# Altium schematic sheet 5_bp_filter.SchDoc
size A; SheetNumber: 5; SheetTotal: 9
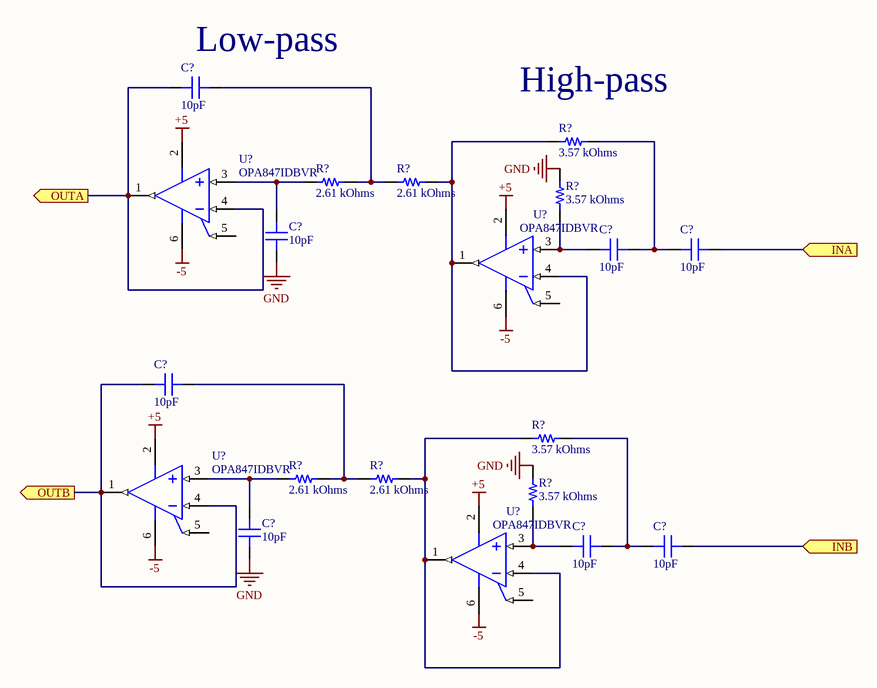
[diagram p0: 5_bp_filter.SchDoc]

## Parts
(Parts that share a designator on the sheet are numbered #1, #2 ... from top to bottom, then left to right.)
C?#1  10pF  [CAP 1206_3216 - 1.0MM]
C?#2  10pF  [CAP 1206_3216 - 1.0MM]
C?#3  10pF  [CAP 1206_3216 - 1.0MM]
C?#4  10pF  [CAP 1206_3216 - 1.0MM]
C?#5  10pF  [CAP 1206_3216 - 1.0MM]
C?#6  10pF  [CAP 1206_3216 - 1.0MM]
C?#7  10pF  [CAP 1206_3216 - 1.0MM]
C?#8  10pF  [CAP 1206_3216 - 1.0MM]
R?#1  3.57 kOhms  [RES 1206_3216]
R?#2  2.61 kOhms  [RES 1206_3216]
R?#3  2.61 kOhms  [RES 1206_3216]
R?#4  3.57 kOhms  [RES 1206_3216]
R?#5  3.57 kOhms  [RES 1206_3216]
R?#6  2.61 kOhms  [RES 1206_3216]
R?#7  2.61 kOhms  [RES 1206_3216]
R?#8  3.57 kOhms  [RES 1206_3216]
U?#1  OPA847IDBVR  [DBV0006A_L]
U?#2  OPA847IDBVR  [DBV0006A_L]
U?#3  OPA847IDBVR  [DBV0006A_L]
U?#4  OPA847IDBVR  [DBV0006A_L]

## Ports
INA (in), INB (in), OUTA (out), OUTB (out)

## Nets
+5: U?#1.2(VS-) U?#2.2(VS-) U?#3.2(VS-) U?#4.2(VS-)
-5: U?#1.6(VS+) U?#2.6(VS+) U?#3.6(VS+) U?#4.6(VS+)
GND: C?#2.1 C?#6.1 R?#4.1 R?#8.1
INA: C?#4.2 ; port INA
INB: C?#8.2 ; port INB
OUTA: C?#1.1 U?#1.1(OUT) U?#1.4(IN-) ; port OUTA
OUTB: C?#5.1 U?#3.1(OUT) U?#3.4(IN-) ; port OUTB
NetC?#1_2: C?#1.2 R?#2.2 R?#3.1
NetC?#2_2: C?#2.2 R?#2.1 U?#1.3(IN+)
NetC?#3_1: C?#3.1 R?#4.2 U?#2.3(IN+)
NetC?#3_2: C?#3.2 C?#4.1 R?#1.2
NetC?#5_2: C?#5.2 R?#6.2 R?#7.1
NetC?#6_2: C?#6.2 R?#6.1 U?#3.3(IN+)
NetC?#7_1: C?#7.1 R?#8.2 U?#4.3(IN+)
NetC?#7_2: C?#7.2 C?#8.1 R?#5.2
NetR?#1_1: R?#1.1 R?#3.2 U?#2.1(OUT) U?#2.4(IN-)
NetR?#5_1: R?#5.1 R?#7.2 U?#4.1(OUT) U?#4.4(IN-)

Not connected (* = marked no-connect by the designer): U?#1 5(~{DIS}); U?#2 5(~{DIS}); U?#3 5(~{DIS}); U?#4 5(~{DIS})

## Notes on the sheet
- (near C?#1) Low-pass
- (near R?#1) High-pass

## Library data of the parts
C?#1-C?#8 = 12065A100JAT2A: CAP CER 10PF 50V C0G/NP0 1206; manufacturer: AVX Corporation; Temperature Coefficient: C0G, NP0; Tolerance: ±5%; Part Number: 12065A100JAT2A; Value: 10pF; Applications: General Purpose; Capacitance: 10pF; componentlink1description: Datasheet; componentlink1url: http://datasheets.avx.com/C0GNP0-Dielectric.pdf; componentlink2description: DigiKey Link; componentlink2url: http://digikey.com/product-detail/en/avx-corporation/12065A100JAT2A/478-1468-1-ND/564500; Device Package: 1206 (3216 Metric); lastupdated: 2020-09-02 01:04:55; Lifecycle Status: Active; Minimum Order: 1; Mounting Type: Surface Mount, MLCC; Operating Temperature: -55°C ~ 125°C; Package / Case: 1206 (3216 Metric); packaging: TapeAndReel; partid: 21175; Part Status: Active; price: 0.07; series: -; Size / Dimension: 0.126" L x 0.063" W (3.20mm x 1.60mm); Supplier 1: DigiKey; Supplier Part Number 1: 478-1468-1-ND; Thickness (Max): 0.037" (0.94mm); Voltage - Rated: 50V
R?#1 R?#4 R?#5 R?#8 = RC1206FR-073K57L: RES 3.57K OHM 1% 1/4W 1206; Manufacturer: Yageo; Power (Watts): 0.25W, 1/4W; Temperature Coefficient: ±100ppm/°C; Part Number: RC1206FR-073K57L; ComponentLink1Description: Datasheet; ComponentLink1URL: https://www.yageo.com/upload/media/product/productsearch/datasheet/rchip/PYu-RC_Group_51_RoHS_L_10.pdf; ComponentLink2Description: DigiKey Link; ComponentLink2URL: https://www.digikey.com/en/products/detail/yageo/RC1206FR-073K57L/728778; Composition: Thick Film; Device Package: 1206 (3216 Metric); Features: Moisture Resistant; Height - Seated (Max): 0.026" (0.65mm); LastUpdated: 2022-09-19 13:29:15; Lifecycle Status: Active; Minimum Order: 1; Number of Terminations: 2; Operating Temperature: -55°C ~ 155°C; Package / Case: 1206 (3216 Metric); Packaging: TapeAndReel; PartId: 35871; Part Status: Active; Price: 0.01; Resistance: 3.57 kOhms; Series: RC_L; Size / Dimension: 0.122" L x 0.063" W (3.10mm x 1.60mm); Supplier 1: DigiKey; Supplier Part Number 1: 311-3.57KFRCT-ND; Supplier Device Package: 1206; Tolerance: ±1%; Value: 3.57 kOhms
R?#2 R?#3 R?#6 R?#7 = ERJ-8ENF2611V: RES SMD 2.61K OHM 1% 1/4W 1206; Manufacturer: Panasonic Electronic Components; Power (Watts): 0.25W, 1/4W; Temperature Coefficient: ±100ppm/°C; Part Number: ERJ-8ENF2611V; ComponentLink1Description: Datasheet; ComponentLink1URL: https://industrial.panasonic.com/cdbs/www-data/pdf/RDA0000/AOA0000C304.pdf; ComponentLink2Description: DigiKey Link; ComponentLink2URL: http://digikey.com/product-detail/en/panasonic-electronic-components/ERJ-8ENF2611V/P2.61KFCT-ND/89734; Composition: Thick Film; Device Package: 1206 (3216 Metric); Features: Automotive AEC-Q200; Height - Seated (Max): 0.028" (0.70mm); LastUpdated: 2022-09-19 13:29:43; Lifecycle Status: Active; Minimum Order: 1; Number of Terminations: 2; Operating Temperature: -55°C ~ 155°C; Package / Case: 1206 (3216 Metric); Packaging: TapeAndReel; PartId: 29522; Part Status: Active; Price: 0.01; Ratings: AEC-Q200; Resistance: 2.61 kOhms; Series: ERJ; Size / Dimension: 0.126" L x 0.063" W (3.20mm x 1.60mm); Supplier 1: DigiKey; Supplier Part Number 1: P2.61KFCT-ND; Supplier Device Package: 1206; Tolerance: ±1%; Value: 2.61 kOhms
U?#1-U?#4 = CMP-0018-00482-2: Wideband, Ultra-Low Noise, Voltage Feedback Operational Amplifier with Shutdown, 10 to 12 V, -40 to 85 degC, 6-pin SOT23 (DBV6), Green (RoHS & no Sb/Br); Manufacturer: Texas Instruments; Vs(Min)(V): 10; Settling Time (0.1%)(Typ)(ns): 20; Number of Channels: 1; THD (Fc is 1 MHz)(Typ)(dB): -96; Iib(Max)(nA): 42000; @ MHz: 5; Iq per channel(Max)(mA): 18.9; 2nd Harmonic(dBc): 105; Io(Typ)(mA): 75; Vn at Flatband(Typ)(nV/rtHz): 0.85; 3rd Harmonic(dBc): 110; Vio(Max)(mV): 0.5; Slew Rate(Typ)(V/us): 950; Acl, min stable gain(V/V): 12; Sub Family: High Output Current Amplifier (>=50mA), High Speed Amplifier (>=50MHz), Low Offset Voltage Amplifier (<=500uV); BW @ Acl(MHz): 600; Mounting Technology: Surface Mount; ComponentLink2URL: http://www.ti.com/general/docs/lit/getliterature.tsp?genericPartNumber=OPA847&fileType=pdf; Eco-Plan: Green (RoHS & no Sb/Br); ComponentLink2Description: Datasheet; Code_JEDEC: MO-178; PackageVersion: 4073253-5/K, 03/2006; PackageDescription: 6-Pin Plastic Small Outline, Body 1.6 x 2.9 mm, Pitch 0.95 mm; DatasheetVersion: SBOS251E; PartNumber: OPA847IDBVR; ComponentLink1Description: Manufacturer URL; ComponentLink3Description: Package Specification; ComponentLink3URL: http://www.ti.com/litv/pdf/mpds026h; ComponentLink1URL: http://www.ti.com/; Vs(Max)(V): 12; PackageReference: DBV0006A